# Altium project H0DR9.PrjPcb (part 2 of 2)

## Sheet H0DR9_Frontend.SchDoc
size Letter; CompanyName: Hexabitz; DocumentNumber: 3; SheetNumber: 2; SheetTotal: 2
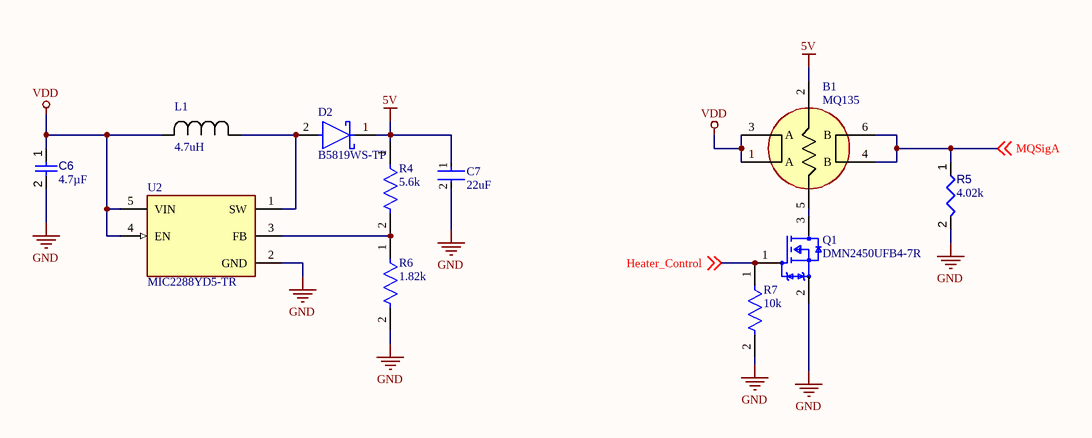
[diagram p1: H0DR9_Frontend.SchDoc]

### Parts
B1  MQ135  [MQ135]
C6  value 4.7µF  [CAPC0603(1608)100_L]  (hidden comment: Capacitor 4.7µF +/-20% 10V 0603)
C7  22uF  [FP-GRM188-0_2-IPC_C]
D2  B5819WS-TP  [FP-SOD-323-IPC_C]
L1  4.7uH  [IND_T4R7M_TAY]
Q1  DMN2450UFB4-7R  [FP-X2-DFN1006-3-MFG]
R4  5.6k  [FP-RMCF0603-IPC_C]
R5  value 4.02k  [RESC0402(1005)_L]  (hidden comment: Resistor 4K02 +/-1 % 0402 63 mW)
R6  1.82k  [FP-RT0603-MFG]
R7  10k  [FP-CRGCQ0603-IPC_C]
U2  MIC2288YD5-TR  [FP-TSOT-5LD-PL-1-MFG]

### Nets
5V: B1.2(Heater) C7.1 D2.1(C) R4.1
GND: C6.2 C7.2 Q1.2(S) R5.2 R6.2 R7.2 U2.2(GND)
VDD: B1.1(A) B1.3(A) C6.1 L1.2 U2.4(EN) U2.5(VIN)
Heater_Control: Q1.1(G) R7.1 ; off-sheet Heater_Control
MQSigA: B1.4(B) B1.6(B) R5.1 ; off-sheet MQSigA
NetB1_5: B1.5(Heater) Q1.3(D)
NetD2_2: D2.2(A) L1.1 U2.1(SW)
NetR4_2: R4.2 R6.1 U2.3(FB)

### Notes on the sheet
- Module:
- Title:
- Description:
- Size:
- Revision:
- Letter
- www.hexabitz.com
- Date:
- Time:
- Sheet
- of

### Library data of the parts
B1 = CMP-007-000000-2: Sensor: gas; ammonia (NH3),benzene; Range: 1010000ppm; MQ-135; Manufacturer_Name: WINSEN; Geometry.Height: 15mm; Manufacturer_Part_Number: MQ135; Mouser Price/Stock: *; Arrow Part Number: *; Datasheet Link: https://www.tme.eu/Document/2578fa81c261e398e9967a2f575c3ebe/MQ135.pdf; Mouser Part Number: *; Arrow Price/Stock: *; Source: MQ135.SchLib; Design Item ID: MQ135; Octopart URL: https://octopart.com/part/winsen-electronics-technology/MQ135
C6 = CMP-001-00076-4: Chip Capacitor, 4.7µF +/-20%, 10V, 0603, Thickness 1 mm; Tolerance: 10%; Mounting Technology: SMT; Case/Package: 0603; Pins: 2; Min Operating Temperature: -55°C; Max Operating Temperature: 85°C; Voltage Rating: 10V
C7 = CMP-2000-06337-3: Chip Multilayer Ceramic Capacitors for General Purpose, 0603, 22uF, X5R, 15%, 20%, 10V; Manufacturer_Name: Murata; Manafacturing_part_number: GRM188R61A226ME15D; Tolerance: 20%; Weight: 0.000222oz; Material: Ceramic; Depth: 0.8mm; Length: 1.6mm; Termination: SMD/SMT; Capacitance: 22uF; Packaging: Tape and Reel; Width: 0.8mm; Voltage Rating: 10V; Case Code (Imperial): 0603; Mount: Surface Mount; Voltage Rating (DC): 10V; Case/Package: 0603; Thickness: 0.039inch; REACH SVHC: No SVHC; Dielectric: X5R; Height: 0.8mm; Package Quantity: 4000; Case Code (Metric): 1608; Min Operating Temperature: -55°C; Lead Free: Lead Free; Max Operating Temperature: 85°C
D2 = CMP-56206-000009-1: DIODE SCHOTTKY 40V 1A SOD323; Manufacturer: MCC; MPN: B5819WS-TR; Max Reverse Leakage Current: 1mA; Peak Non-Repetitive Surge Current: 10A; Forward Voltage: 900mV; Element Configuration: Single; Value: 48pF; Max Junction Temperature (Tj): 125°C; Max Power Dissipation: 250mW; Number of Elements: 1; Peak Reverse Current: 40µA; Max Reverse Voltage (DC): 40V; Number of Pins: 2; Max Operating Temperature: 125°C; Package Quantity: 1; Radiation Hardening: No; Average Rectified Current: 1A; Lead Free: Lead Free; Series: -; Mount: Surface Mount; Min Operating Temperature: -65°C; RoHS Compliant: Yes; Packaging: Tape and Reel; Max Surge Current: 10A; Supplier: Arrow Electronics; Supplier Part Number: B5819WS-TP; Manufacturer Part Number: B5819WS-TP; RoHS: Compliant; Category: Rectifier Diodes; Stock: 33000; Pricing: 3000=0.0424, 6000=0.042, 9000=0.038 (USD); China RoHS: Compliant; Forward Current: 1A; Height: 1.15mm; Lifecycle Status: Production; Max Forward Surge Current (Ifsm): 10A; Max Output current: 1A; Max Repetitive Reverse Voltage (Vrrm): 40V; Mounting Technology: Surface Mount; Pins: 2; Number of Terminals: 2; REACH SVHC: Yes; Reverse Standoff Voltage: 40V; Reverse Voltage: 40V; Schedule B: 8541100080, 8541100080|8541100080|8541100080|8541100080|8541100080; ComponentLink1URL: https://datasheet.octopart.com:443/B5819WS-TP-MCC-datasheet-179878064.pdf?src-supplier=element14+APAC; ComponentLink1Description: https://datasheet.octopart.com:443/B5819WS-TP-MCC-datasheet-179878064.pdf?src-supplier=element14+APAC; ComponentLink2URL: https://datasheet.octopart.com:443/B5819WS-TP-MCC-datasheet-13536386.pdf?src-supplier=Future+Electronics; ComponentLink2Description: https://datasheet.octopart.com:443/B5819WS-TP-MCC-datasheet-13536386.pdf?src-supplier=Future+Electronics; ComponentLink3URL: https://datasheet.octopart.com:443/B5819WS-TP-MCC-datasheet-103922694.pdf?src-supplier=Future+Electronics; ComponentLink3Description: https://datasheet.octopart.com:443/B5819WS-TP-MCC-datasheet-103922694.pdf?src-supplier=Future+Electronics; ComponentLink4URL: https://datasheet.octopart.com:443/B5819WS-TP-MCC-datasheet-11893626.pdf?src-supplier=Arrow+Electronics; ComponentLink4Description: https://datasheet.octopart.com:443/B5819WS-TP-MCC-datasheet-11893626.pdf?src-supplier=Arrow+Electronics; Manafacturer_Name: MCC
L1 = CMP-006-00021-1: No Description Available; Manufacturer_Name: TAIYO YUDEN; Manufacturer_Part_Number: MBKK2012T4R7M; Copyright: Copyright (C) 2025 Ultra Librarian. All rights reserved.; Design Item ID: MBKK2012T4R7M; Source: MBKK2012T4R7M.SchLib
Q1 = CMP-00461-91620622-2: DMN2450UFB4-7R Trans Mosfet N-ch 20V 1A 3-PIN Dfn SMD T/r; Manufacturer: Diodes Inc.; Number of Channels: 1; Power Dissipation: 500mW; Turn-Off Delay Time: 18.1ns; Drain to Source Resistance: 300mΩ; Max Junction Temperature (Tj): 150°C; Turn-On Delay Time: 5.3ns; Gate to Source Voltage (Vgs): 12V; Max Power Dissipation: 900mW; Height: 400µm; Continuous Drain Current (ID): 1A; Drain to Source Breakdown Voltage: 20V; NexarPartId: 91620622; Max Operating Temperature: 150°C; Drain to Source Voltage (Vdss): 20V; Min Operating Temperature: -55°C; Supplier: Avnet; Supplier Part Number: DMN2450UFB4-7R; Manufacturer Part Number: DMN2450UFB4-7R; RoHS: Compliant; Category: MOSFETs; Stock: 132000; Pricing: 3000=0.03136, 6000=0.0312, 12000=0.03104, 24000=0.03088, 48000=0.03072 (USD); China RoHS: Compliant; Lifecycle Status: Production; Min Breakdown Voltage: 20V; Number of Elements: 1; Number of Terminals: 3; REACH SVHC: Yes; ComponentLink1URL: https://sigma.octopart.com:443/138896371/technical_drawing/Diodes-Inc.-DMN2450UFB4-7R.pdf?src-supplier=Upverter; ComponentLink1Description: https://sigma.octopart.com:443/138896371/technical_drawing/Diodes-Inc.-DMN2450UFB4-7R.pdf?src-supplier=Upverter; ComponentLink2URL: https://datasheet.octopart.com:443/DMN2450UFB4-7R-Diodes-Inc.-datasheet-133510387.pdf?src-supplier=IHS; ComponentLink2Description: https://datasheet.octopart.com:443/DMN2450UFB4-7R-Diodes-Inc.-datasheet-133510387.pdf?src-supplier=IHS
R4 = CMP-26527-005608-1: 5.6kΩ ±5% 0.1W 0603 Thick Film Chip Resistor AEC-Q200 compliant; Resistance: 5.6kR; Temperature Coefficient: 200ppm/°C; Max Power Dissipation: 100mW; Series: RMCF; Height: 0.022inch; Contact Plating: Tin; Tolerance: 5%; Mount: Surface Mount; Resistor Type: Thick Film; Min Operating Temperature: -55°C; Case/Package: 0603; Length: 0.061inch; Features: Automotive AEC-Q200; Width: 0.031inch; Packaging: Tape and Reel; Number of Terminations: 2; Radiation Hardening: No; RoHS Compliant: Yes; Max Operating Temperature: 155°C; Package Quantity: 10000
R5 = CMP-009-00153-3: Chip Resistor, 4,02 kOhms, +/-1 %, 63 mW, -55 to 155 degC, 0402; Power: 63mW; Tolerance: 1%; Min Operating Temperature: -55°C; Pins: 2; Case/Package: 0402; Max Operating Temperature: 155°C
R6 = CMP-2000-04394-2: RES SMD 1.82K OHM 0.1% 1/10W; Manufacturer Part Number: RT0603BRD071K82L; Manufacturer: Yageo; Resistance: 1.82KΩ; Power Rating: 0.1W; Tolerance: 0.001; Value: 1.82KΩ; Voltage Rating: 75V; Temperature Coefficient: 25 ppm/°C; Frequency: 1.2MHz; Max Duty Cycle: 90%; Max Supply Voltage: 10V; Max Junction Temperature (Tj): 125°C; Max Output current: 1A; Max Output Voltage: 34V; Min Input Voltage: 2.5V; Nominal Supply Current: 2.8mA; Number of Channels: 1; Output Configuration: Positive; Output Type: Adjustable; Synchronous Rectifier: No; Topology: Boost; ComponentLink2URL: http://www.yageo.com/documents/recent/PYu-RT_1-to-0.01_RoHS_L_9.pdf; Ipc Land Pattern Name: RESC16080X45; Temperature Range High: +155°C; Package: RT0603; Height: 0.55mm; Octopart: https://octopart.com/rt0603brd071k82l-yageo-1442926; ComponentLink2Description: Datasheet; RoHS: TRUE; Temperature Range Low: -55°C; Lead Free: Yes; Device Class L2: Resistors; Device Class L1: Passive Components; Digikey Description: RES SMD 1.82K OHM 0.1% 1/10W; Composition: Thin Film; Temperature: -55°C to +155°C; Device Class L3: Chip SMD Resistors; Series: RT; Automotive: No; Mouser Description: Thin Film Resistors - SMD 1/10W 1.82K ohm .1% 25ppm; Category: Res; Footprint Url: http://www.yageo.com/exep/pages/download/literatures/PYu-R_Mount_10.pdf; Supplier: Newark; Supplier Part Number: MIC2288YD5-TR; Stock: 3000; Pricing: 3000=0.583 (USD); Projected EOL Date: 2034-01-20; Case/Package: TSOT; Country of Assembly: Malaysia, Thailand; Country of Fabrication: United States of America; Country of Origin: Malaysia, Thailand; Export Control Classification Number (ECCN) Code: EAR99; Harmonized Tariff Schedule (HTS) Code: 8542.39.0060; Length: 2.9mm; Lifecycle Status: Production; Max Operating Temperature: 125°C; Min Operating Temperature: -40°C; Min Output Voltage: 2.5V; Min Supply Voltage: 2.5V; Mounting Technology: Surface Mount; Number of Outputs: 1; Pins: 5; Operating Supply Voltage: 10V; Output Current: 1A; Output Voltage: 34V; Radiation Hardening: No; REACH SVHC: No; Schedule B: 8542390000, 8542390000|8542390000|8542390000|8542390000|8542390000; Switching Frequency: 1.2MHz; Width: 1.6mm; ComponentLink1URL: https://datasheet.octopart.com:443/MIC2288YD5-TR-Microchip-datasheet-175858761.pdf?src-supplier=Microchip; ComponentLink1Description: https://datasheet.octopart.com:443/MIC2288YD5-TR-Microchip-datasheet-175858761.pdf?src-supplier=Microchip; ComponentLink3URL: https://datasheet.octopart.com:443/MIC2288YD5-TR-Microchip-datasheet-19250.pdf?src-supplier=Upverter; ComponentLink3Description: https://datasheet.octopart.com:443/MIC2288YD5-TR-Microchip-datasheet-19250.pdf?src-supplier=Upverter; ComponentLink4URL: https://datasheet.octopart.com:443/MIC2288YD5-TR-Microchip-datasheet-137404901.pdf?src-supplier=Upverter; ComponentLink4Description: https://datasheet.octopart.com:443/MIC2288YD5-TR-Microchip-datasheet-137404901.pdf?src-supplier=Upverter; ComponentLink5URL: https://datasheet.octopart.com:443/MIC2288YD5-TR-Microchip-datasheet-141892128.pdf?src-supplier=Augswan; ComponentLink5Description: https://datasheet.octopart.com:443/MIC2288YD5-TR-Microchip-datasheet-141892128.pdf?src-supplier=Augswan; ComponentLink6URL: https://datasheet.octopart.com:443/MIC2288YD5-TR-Microchip-datasheet-142675560.pdf?src-supplier=TME; ComponentLink6Description: https://datasheet.octopart.com:443/MIC2288YD5-TR-Microchip-datasheet-142675560.pdf?src-supplier=TME; ComponentLink7URL: https://datasheet.octopart.com:443/MIC2288YD5-TR-Microchip-datasheet-78862009.pdf?src-supplier=Microchip+SCT; ComponentLink7Description: https://datasheet.octopart.com:443/MIC2288YD5-TR-Microchip-datasheet-78862009.pdf?src-supplier=Microchip+SCT; ComponentLink8URL: http://sigma.octopart.com:80/188455326/materials_sheet/Microchip-MIC2288YD5-TR.pdf?src-supplier=Compliance+Statements; ComponentLink8Description: http://sigma.octopart.com:80/188455326/materials_sheet/Microchip-MIC2288YD5-TR.pdf?src-supplier=Compliance+Statements; ComponentLink9URL: http://sigma.octopart.com:80/conflict_mineral_statement/Microchip-company-68.pdf?src-supplier=Compliance+Statements; ComponentLink9Description: http://sigma.octopart.com:80/conflict_mineral_statement/Microchip-company-68.pdf?src-supplier=Compliance+Statements; ComponentLink10URL: http://sigma.octopart.com:80/conflict_mineral_statement/Microchip-company-69.pdf?src-supplier=Compliance+Statements; ComponentLink10Description: http://sigma.octopart.com:80/conflict_mineral_statement/Microchip-company-69.pdf?src-supplier=Compliance+Statements; ComponentLink11URL: http://sigma.octopart.com:80/reach_statement/Microchip-company-70.pdf?src-supplier=Compliance+Statements; ComponentLink11Description: http://sigma.octopart.com:80/reach_statement/Microchip-company-70.pdf?src-supplier=Compliance+Statements; ComponentLink12URL: http://sigma.octopart.com:80/rohs_statement/Microchip-company-71.pdf?src-supplier=Compliance+Statements; ComponentLink12Description: http://sigma.octopart.com:80/rohs_statement/Microchip-company-71.pdf?src-supplier=Compliance+Statements
R7 = CMP-03211-009884-1: CRGCQ 0603 10K 5%; Manufacturer Part Number: CRGCQ0603J10K; Manufacturer: TE Connectivity; Tolerance: 0.05; Power Rating: 0.1W; Resistance: 10KΩ; Voltage Rating: 75V; Value: 10KΩ; Temperature Coefficient: ±100ppm/°C; Composition: Thick Film; ComponentLink2URL: https://www.te.com/commerce/DocumentDelivery/DDEController?Action=showdoc&DocId=Data+Sheet%7F1773204-3%7F1%7Fpdf%7FEnglish%7FENG_DS_1773204-3_1.pdf%7F4-2176339-923; Device Class L1: Passive Components; Package: CRGCQ0603; Mouser Description: Res Thick Film 0603 10K Ohm 5% 0.1W(1/10W) ±100ppm/C Pad SMD Automotive T/R; Temperature Range High: +155°C; Category: Res; Device Class L2: Resistors; Height: 0.55mm; RoHS: TRUE; Lead Free: Yes; Ipc Land Pattern Name: RESC16080X45; Temperature: -55°C to +155°C; Series: CRGCQ; Digikey Description: CRGCQ 0603 10K 5%; Octopart: https://octopart.com/crgcq0603j10k-te+connectivity-91018097; Device Class L3: Chip SMD Resistors; Ambient Temperature Range High: +70°C; ComponentLink2Description: Datasheet; Temperature Range Low: -55°C
U2 = CMP-06325-000011-1: IC REG BOOST ADJ 1.2A TSOT23-5; Manufacturer: Microchip; Number of Outputs: 1; Output Current: 1A; Operating Supply Voltage: 10V; Switching Frequency: 1.2MHz; Output Configuration: Positive; Max Output Voltage: 34V; Min Input Voltage: 2.5V; Synchronous Rectifier: No; Output Type: Adjustable; Max Duty Cycle: 90%; Max Junction Temperature (Tj): 125°C; Nominal Supply Current: 2.8mA; Max Input Voltage: 10V; Width: 1.6mm; Max Output Current: 1A; Packaging: Tape and Reel; Max Operating Temperature: 125°C; Min Operating Temperature: -40°C; Package Quantity: 3000; Height: 0.87mm; Output Voltage: 34V; Min Output Voltage: 2.5V; Lead Free: Lead Free; Length: 2.9mm; REACH SVHC: No SVHC; Radiation Hardening: No; Min Supply Voltage: 2.5V; Case/Package: TSOT; Number of Pins: 5; Mount: Surface Mount; Topology: Boost; Supplier: Newark; Supplier Part Number: MIC2288YD5-TR; Manufacturer Part Number: MIC2288YD5-TR; RoHS: Compliant; Category: Voltage Regulators - Switching; Stock: 3000; Pricing: 3000=0.583 (USD); Projected EOL Date: 2034-01-20; Country of Assembly: Malaysia, Thailand; Country of Fabrication: United States of America; Country of Origin: Malaysia, Thailand; Export Control Classification Number (ECCN) Code: EAR99; Frequency: 1.2MHz; Harmonized Tariff Schedule (HTS) Code: 8542.39.0060; Lifecycle Status: Production; Max Supply Voltage: 10V; Mounting Technology: Surface Mount; Number of Channels: 1; Pins: 5; Schedule B: 8542390000, 8542390000|8542390000|8542390000|8542390000|8542390000; ComponentLink1URL: https://datasheet.octopart.com:443/MIC2288YD5-TR-Microchip-datasheet-175858761.pdf?src-supplier=Microchip; ComponentLink1Description: https://datasheet.octopart.com:443/MIC2288YD5-TR-Microchip-datasheet-175858761.pdf?src-supplier=Microchip; ComponentLink2URL: https://datasheet.octopart.com:443/MIC2288YD5-TR-Microchip-datasheet-19250.pdf?src-supplier=Upverter; ComponentLink2Description: https://datasheet.octopart.com:443/MIC2288YD5-TR-Microchip-datasheet-19250.pdf?src-supplier=Upverter; ComponentLink3URL: https://datasheet.octopart.com:443/MIC2288YD5-TR-Microchip-datasheet-137404901.pdf?src-supplier=Upverter; ComponentLink3Description: https://datasheet.octopart.com:443/MIC2288YD5-TR-Microchip-datasheet-137404901.pdf?src-supplier=Upverter; ComponentLink4URL: https://datasheet.octopart.com:443/MIC2288YD5-TR-Microchip-datasheet-141892128.pdf?src-supplier=Augswan; ComponentLink4Description: https://datasheet.octopart.com:443/MIC2288YD5-TR-Microchip-datasheet-141892128.pdf?src-supplier=Augswan; ComponentLink5URL: https://datasheet.octopart.com:443/MIC2288YD5-TR-Microchip-datasheet-142675560.pdf?src-supplier=TME; ComponentLink5Description: https://datasheet.octopart.com:443/MIC2288YD5-TR-Microchip-datasheet-142675560.pdf?src-supplier=TME; ComponentLink6URL: https://datasheet.octopart.com:443/MIC2288YD5-TR-Microchip-datasheet-78862009.pdf?src-supplier=Microchip+SCT; ComponentLink6Description: https://datasheet.octopart.com:443/MIC2288YD5-TR-Microchip-datasheet-78862009.pdf?src-supplier=Microchip+SCT; ComponentLink7URL: http://sigma.octopart.com:80/188455326/materials_sheet/Microchip-MIC2288YD5-TR.pdf?src-supplier=Compliance+Statements; ComponentLink7Description: http://sigma.octopart.com:80/188455326/materials_sheet/Microchip-MIC2288YD5-TR.pdf?src-supplier=Compliance+Statements; ComponentLink8URL: http://sigma.octopart.com:80/conflict_mineral_statement/Microchip-company-68.pdf?src-supplier=Compliance+Statements; ComponentLink8Description: http://sigma.octopart.com:80/conflict_mineral_statement/Microchip-company-68.pdf?src-supplier=Compliance+Statements; ComponentLink9URL: http://sigma.octopart.com:80/conflict_mineral_statement/Microchip-company-69.pdf?src-supplier=Compliance+Statements; ComponentLink9Description: http://sigma.octopart.com:80/conflict_mineral_statement/Microchip-company-69.pdf?src-supplier=Compliance+Statements; ComponentLink10URL: http://sigma.octopart.com:80/reach_statement/Microchip-company-70.pdf?src-supplier=Compliance+Statements; ComponentLink10Description: http://sigma.octopart.com:80/reach_statement/Microchip-company-70.pdf?src-supplier=Compliance+Statements; ComponentLink11URL: http://sigma.octopart.com:80/rohs_statement/Microchip-company-71.pdf?src-supplier=Compliance+Statements; ComponentLink11Description: http://sigma.octopart.com:80/rohs_statement/Microchip-company-71.pdf?src-supplier=Compliance+Statements

## Nets that join several sheets
GND: H0DR9_Backend (13 pins), H0DR9_Frontend (7 pins)
VDD: H0DR9_Backend (8 pins), H0DR9_Frontend (6 pins)
Heater_Control: H0DR9_Backend (U1.17), H0DR9_Frontend (Q1.1 R7.1)
MQSigA: H0DR9_Backend (U1.18), H0DR9_Frontend (B1.4 B1.6 R5.1)